# Altium schematic sheet 12. uSD.SchDoc
size A4
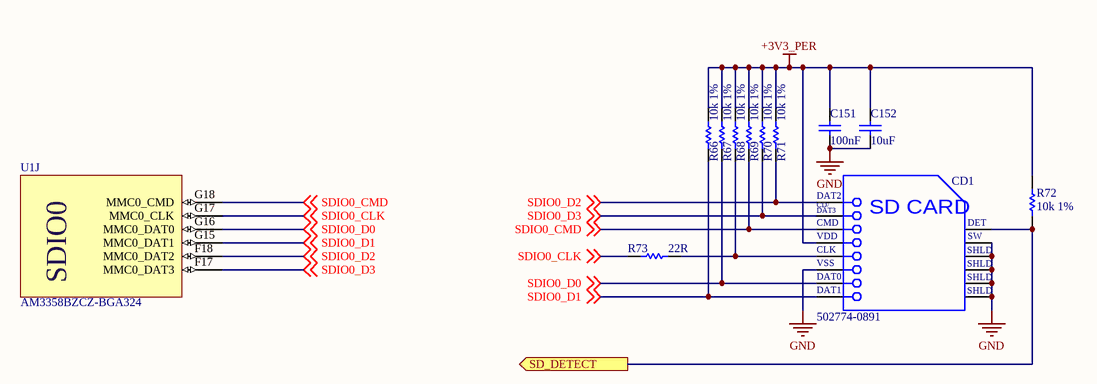
[diagram p0: 12. uSD.SchDoc]

## Parts
C151  100nF  [CAPC1005X55X25LL05T10]
C152  10uF  [CAPC1608X90X35NL10T15]
CD1  502774-0891  [MOLX-502774-0891_V]
R66  10k 1%  [RESC1005X40X25LL05T05]
R67  10k 1%  [RESC1005X40X25LL05T05]
R68  10k 1%  [RESC1005X40X25LL05T05]
R69  10k 1%  [RESC1005X40X25LL05T05]
R70  10k 1%  [RESC1005X40X25LL05T05]
R71  10k 1%  [RESC1005X40X25LL05T05]
R72  10k 1%  [RESC1005X40X25LL05T05]
R73  22R  [RESC1005X40X25LL05T05]
U1  AM3358BZCZ-BGA324  [TI-ZCZ324]  (part J of 11)

## Ports
SD_DETECT (out)

## Nets
+3V3_PER: C151.2 C152.2 CD1.4(VDD) R66.2 R67.2 R68.2 R69.2 R70.2 R71.2 R72.2
GND: C151.1 C152.1 CD1.6(VSS) CD1.10(SWITCH) CD1.11(SHLD) CD1.12(SHLD) CD1.13(SHLD) CD1.14(SHLD)
SD_DETECT: CD1.9(DETECT) R72.1 ; port SD_DETECT
SDIO0_CLK: R73.1 U1.G17(MMC0_CLK) ; off-sheet SDIO0_CLK
SDIO0_CMD: CD1.3(CMD) R69.1 U1.G18(MMC0_CMD) ; off-sheet SDIO0_CMD
SDIO0_D0: CD1.7(DAT0) R67.1 U1.G16(MMC0_DAT0) ; off-sheet SDIO0_D0
SDIO0_D1: CD1.8(DAT1) R66.1 U1.G15(MMC0_DAT1) ; off-sheet SDIO0_D1
SDIO0_D2: CD1.1(DAT2) R71.1 U1.F18(MMC0_DAT2) ; off-sheet SDIO0_D2
SDIO0_D3: CD1.2(CD/DAT3) R70.1 U1.F17(MMC0_DAT3) ; off-sheet SDIO0_D3
NetCD1_5: CD1.5(CLK) R68.1 R73.2

## Notes on the sheet
- Title
- Size:
- Date:
- A4
- Number:
- Time:
- Revision:
- Sheet
- of
- N.S.T
- Design by:
- Check by:
- https://github.com/tung080827
- (in symbol AM3358BZCZ100, part J) SDIO0
- (in symbol CMP-2000-05248-1) CD/; DAT3; SD CARD; DET; SW

## Library data of the parts
C151 = CMP-2100-03641-1: Chip Capacitor, 0.1 uF, +/- 10%, 16 V, -55 to 125 degC, 0402 (1005 Metric), RoHS, Tape and Reel; Manufacturer: Murata; Material: Ceramic; Insulation Resistance: 10GR; Voltage: 16V; Dielectric: X7R; REACH SVHC: NoSVHC; Depth: 0.5mm; Case/Package: 0402; Datasheet URL: http://psearch.en.murata.com/capacitor/product/GRM155R71C104KA88%23.pdf; Lead Free: LeadFree; Dielectric Material: Ceramic; Manufacturer URL: http://www.murata.com/; Min Operating Temperature: -55degC; Length: 1mm; Case Code (Metric): 1005; Radiation Hardening: No; Package Reference: 0402; RoHSCompliant: true; Datasheet Version: 42675.0; Thickness: 0.022inch; Packaging: TapeandReel; Voltage Rating (DC): 16V; Tolerance: 10%; Max Operating Temperature: 125degC; Package Description: 2-Pin Surface Mount Device, Body 1 x 0.5 mm; Mount: SurfaceMount; Height: 0.5mm; Width: 0.5mm; Number of Pins: 2; Voltage Rating: 16V; Case Code (Imperial): 0402; Termination: SMD/SMT; Capacitance: 100nF; Package Quantity: 1
C152 = CMP-2006-02792-1: Chip Capacitor, 10 uF, +/- 10%, 6.3 V, -55 to 125 degC, 0603 (1608 Metric), RoHS, Tape and Reel; Part Number: GRM188R60J106ME47D; Manufacturer: Murata
CD1 = CMP-2000-05248-1: Micro SD Memory Card Connector, 0.5 A, 10 V (DC), -25 to 85 degC, 8-Pin SMT, RoHS, Tape and Reel; Manufacturer: Molex; 3D Model: 502774-0891.stp; Online Catalog: microSD™Series; Number of Positions: 10(8+2); Card Type: SecureDigital-microSD™; Insertion, Removal Method: PushIn,PushOut; Other Names: WM24066DKR; Connector Type: ConnectorandEjector; Features: Switch; Family: MemoryConnectors-PCCardSockets; Manufacturer URL: http://www.molex.com/; Mounting Type: SurfaceMount,RightAngle; Contact Finish Thickness: 20µin(0.51µm); Standard Package: 1; Series: 502774; Ejector Side: -; Datasheet Version: Rev. D, 04/2004; Category: Connectors,Interconnects; Contact Finish: Gold; Datasheet URL: https://datasheet.ciiva.com/1104/1499551-1104671.pdf; RoHS Information: 502774-0891CertofCompliance; Mounting Feature: Reverse-Bottom; Packaging: Digi-Reel; Height Above Board: 0.071"(1.80mm); Catalog Drawings: 502774-0891
R66-R72 = CMP-2002-08135-1: 10k 0.063W 1% 0402 (1005 Metric)  SMD; Manufacturer: Vishay Dale; Part Number: CRCW040210K0FKED
R73 = CMP-1665-00027-3: Chip Resistor, 22 Ohm, +/- 1%, 0.1 W, -55 to 155 degC, 0402 (1005 Metric), RoHS, Tape and Reel; PartNumber: ERJ-2RKF22R0X; Case\/Package: 0402; Resistance: 22 Ohm; Power Rating: 100 mW; Voltage Rating: 50 V; ComponentLink2Description: Datasheet; Packaging: Tape and Reel; Weight: 2.8E-05oz; Pins: 2; Case Code (Imperial): 0402; Width: 0.5 mm; ComponentLink2URL: http://industrial.panasonic.com/cdbs/www-data/pdf/RDA0000/AOA0000C86.pdf; Height: 0.35 mm; PackageReference: 0402; REACH SVHC: Yes; Min Operating Temperature: -55 degC; Length: 1 mm; DatasheetVersion: 04/2015; RoHSCompliant: true; Package Quantity: 10000; Case Code (Metric): 1005; PackageDescription: 2-Pin Surface Mount Device, Body 1 x 0.5 mm; ComponentLink1URL: http://www.panasonic.com/; Mount: Surface Mount; Mounting Technology: Surface Mount; Tolerance: 1%; Max Operating Temperature: 155 degC; ComponentLink1Description: Manufacturer URL
U1 = AM3358BZCZ100: Sitara ARM Cortex-A8 32-Bit RISC Microprocessor, 1 GHz, SGX530 3D Graphics Engine, Programmable Real-Time Unit and Industrial Communication Subsystem (PRU-ICSS), 0 to 90 degC, 324-pin NFBGA (ZCZ), Green (RoHS & no Sb/Br); Supplier 1: Digi-Key